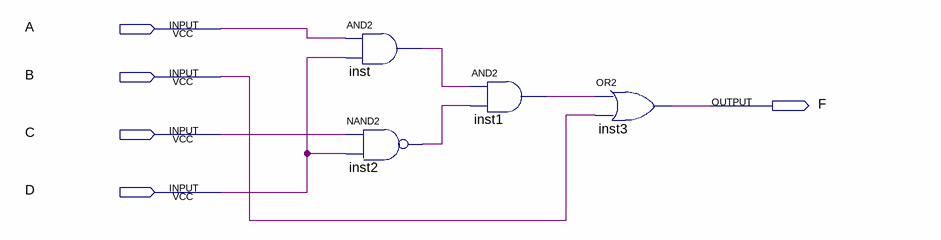
[diagram p0: schematic sheet]
// Quartus schematic Demo_Sockit.bdf as structural Verilog: 4 symbols, 5 pins
module Demo_Sockit (
  input  A,
  input  B,
  input  C,
  input  D,
  output F
);

  wire inst1_out, inst2_out, inst_out;

  and inst (inst_out, A, D);
  nand inst2 (inst2_out, C, D);
  and inst1 (inst1_out, inst_out, inst2_out);
  or inst3 (F, inst1_out, B);
endmodule
